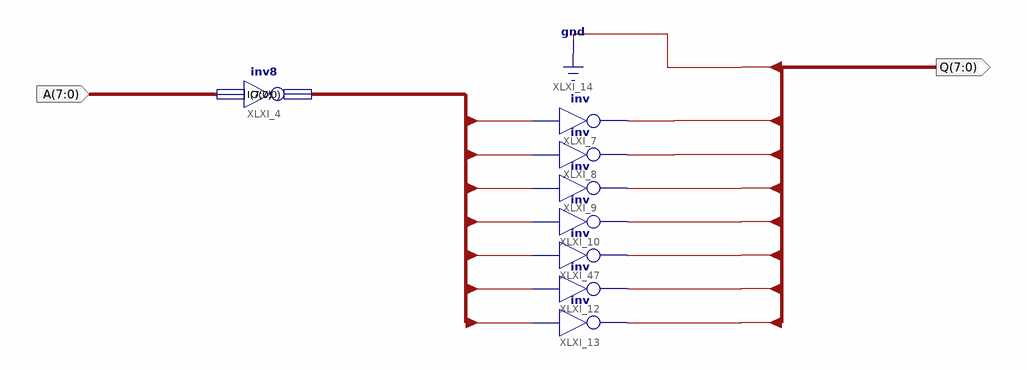
[diagram p0: schematic sheet 1]
// Xilinx ISE schematic SHL2.sch (spartan6) as structural Verilog: 8 symbols, 2 ports
module SHL2 (
  input  [7:0] A,
  output [7:0] Q
);

  wire [7:0] Z;

  inv8 XLXI_4 (.I(A), .O(Z));
  not XLXI_7 (Q[6], Z[7]);
  not XLXI_8 (Q[5], Z[6]);
  not XLXI_9 (Q[4], Z[5]);
  not XLXI_10 (Q[3], Z[4]);
  not XLXI_47 (Q[2], Z[3]);
  not XLXI_12 (Q[1], Z[2]);
  not XLXI_13 (Q[0], Z[1]);

  assign Q[7] = 1'b0;
endmodule
